# Altium project AI Gateway - Carrier.PrjPcb (part 2 of 2)

## Sheet 12-RS485.SchDoc
size A4
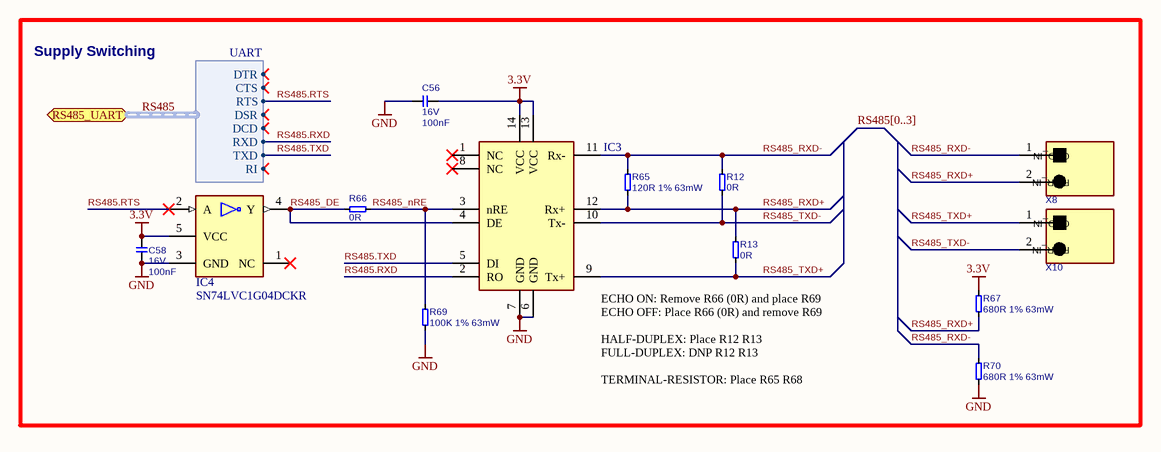
[diagram p7: 12-RS485.SchDoc]

### Parts
C56  value 100nF  Rating: 16V  [CAPC1005X60N]  (hidden comment: 100nF 16V 10% X7R)
C58  value 100nF  Rating: 16V  [CAPC1005X60N]  (hidden comment: 100nF 16V 10% X7R)
IC3  ISL83491IBZ-T  [SOIC127P600X175-14N]  (value not drawn)
IC4  SN74LVC1G04DCKR  [SOT65P210X110-5N]
R12  0R  [RESC1005X40N]
R13  0R  [RESC1005X40N]
R65  120R 1% 63mW  [RESC1005X40N]
R66  0R  [RESC1005X40N]
R67  680R 1% 63mW  [RESC1005X40N]
R69  100K 1% 63mW  [RESC1005X40N]
R70  680R 1% 63mW  [RESC1005X40N]
X8  1984617  [TERM-BLK-3.5MM]  (value not drawn)
X10  1984617  [TERM-BLK-3.5MM]  (value not drawn)

### Blocks framed on the sheet
Supply Switching: C56 C58 IC3 IC4 R12 R13 R65-R67 R69 R70 X8 X10

### Ports
RS485_UART (bidir, harness UART)

### Harnesses
UART: RTS, DSR, DCD, RXD, TXD, CTS, DTR, RI

### Nets
3.3V: C56.1 C58.2 IC3.13(VCC) IC3.14(VCC) IC4.5(VCC) R67.2
GND: C56.2 C58.1 IC3.6(GND) IC3.7(GND) IC4.3(GND) R69.1 R70.1
RS485.RTS: IC4.2(A) ; port RS485_UART.RTS
RS485.RXD: IC3.2(RO) ; port RS485_UART.RXD
RS485.TXD: IC3.5(DI) ; port RS485_UART.TXD
RS485_DE: IC3.4(DE) IC4.4(Y) R66.2
RS485_nRE: IC3.3(nRE) R66.1 R69.2
RS485_RXD+: IC3.12(Rx+) R13.2 R65.1 R67.1 X8.2(PWR_IN)
RS485_RXD-: IC3.11(Rx-) R12.1 R65.2 R70.2 X8.1(GND_IN)
RS485_TXD+: IC3.9(Tx+) R13.1 X10.1(GND_IN)
RS485_TXD-: IC3.10(Tx-) R12.2 X10.2(PWR_IN)

Not connected (* = marked no-connect by the designer): IC3 1(NC)* 8(NC)*; IC4 1(NC)*

### Buses and harness runs
bus RS485[0..3]
harness RS485 = port RS485_UART

### Notes on the sheet
- ECHO ON: Remove R66 (0R) and place R69
  ECHO OFF: Place R66 (0R) and remove R69
  HALF-DUPLEX: Place R12 R13
  FULL-DUPLEX: DNP R12 R13
  TERMINAL-RESISTOR: Place R65 R68

### Library data of the parts
C56 C58 = C-100nF-16V-10%-0603: Capacitor Ceramic X7R 100nF 16V 10% 0603; FP_DESC: C0402; Tolerance: 10%; Type: X7R; Supplier 1: Digi-Key; Supplier Part Number 1: 1276-1001-1-ND; Footprint Checked: -; MFG: *; MFG_PN: *
IC3 = IC-Renesas-ISL83491IBZ-T: Transceptor 1/1 Completo RS422, RS485 14-SOIC; MFG: Renesas Electronics America Inc; Supplier 1: Digi-Key; Supplier Part Number 1: ISL83491IBZ-TCT-ND; Symbol Checked: -; Footprint Checked: -; MFG_PN: ISL83491IBZ-T
IC4 = IC-TI-SN74LVC1G04: IC INVERTER 1CH 1-INP SC70-5; Symbol Checked: M - D; MFG: Texas Instruments; Supplier 1: Digi-Key; Supplier Part Number 1: 296-11600-1-ND; Footprint Checked: -; MFG_PN: SN74LVC1G04
R12 R13 R66 = R-0R-0402: Resistor 0ohm 0402; Tolerance: 1%; MFG: <GENERIC>; Power: ?; Value: 0R; Footprint: R0402; Supplier 1: Digi-Key; Supplier Part Number 1: 541-2952-1-ND; Footprint Checked: -; MFG_PN: <GENERIC>; Symbol Checked: -
R65 = R-120R-1%-0402: Resistor 120ohm 63mW 1% 0402; MFG: <GENERIC>; Power: 63mW; Tolerance: 1%; Footprint: R0402; Value: 120R; Supplier 1: Digi-Key; Supplier Part Number 1: 541-120LCT-ND; Footprint Checked: -; Symbol Checked: -; MFG_PN: <GENERIC>
R67 R70 = R-680R-1%-0402: Resistor 680ohm 63mW 1% 0402; Value: 680; MFG: <GENERIC>; Power: 63mW; Tolerance: 1%; Footprint: R0402; Supplier 1: Digi-Key; Supplier Part Number 1: 541-680LCT-ND; Footprint Checked: -; Symbol Checked: -; MFG_PN: <GENERIC>
R69 = R-100K-1%-0402: as R49 on sheet 07-USB; Power: 63mW; Tolerance: 1%; Value: 100k; Footprint: R0402; Supplier 1: Digi-Key; Supplier Part Number 1: 541-100KLCT-ND; Manufacturer Part Number: <GENERIC>
X8 X10 = CON-Phoenix-1984617-1x2-3.5mm: 2 Position Wire to Board Terminal Block Horizontal with Board 0.138" (3.50mm) Through Hole; No. of ways: 1x2; Pitch: 3.5mm; MFG: Phoenix Contact; Supplier 1: Digi-Key; Supplier Part Number 1: 277-1721-ND; Footprint Checked: -; MFG_PN: 1984617; Symbol Checked: -

## Sheet 05-SD CARD.SchDoc
size A4
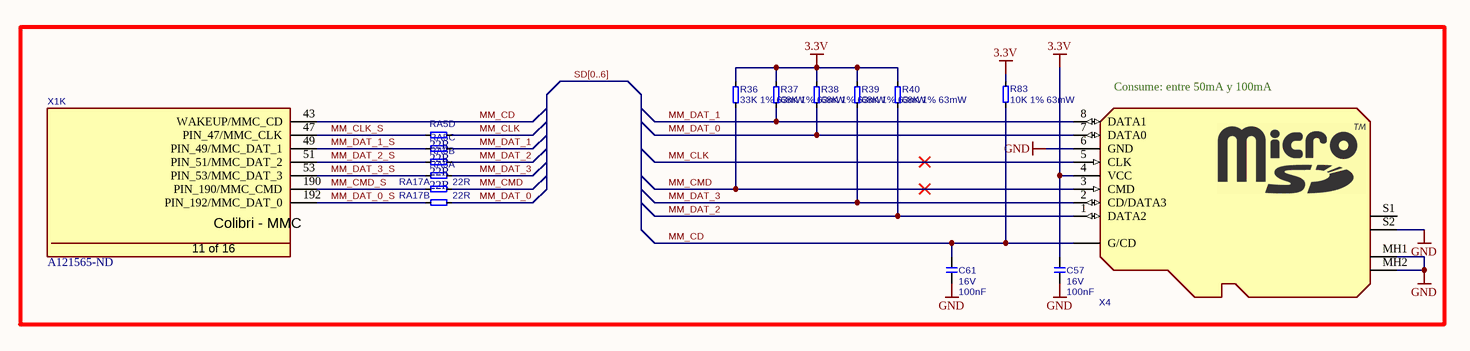
[diagram p8: 05-SD CARD.SchDoc]

### Parts
C57  value 100nF  Rating: 16V  [CAPC1005X60N]  (hidden comment: 100nF 16V 10% X7R)
C61  value 100nF  Rating: 16V  [CAPC1005X60N]  (hidden comment: 100nF 16V 10% X7R)
R36  33K 1% 63mW  [RESC1005X40N]
R37  68K 1% 63mW  [RESC1005X40N]
R38  68K 1% 63mW  [RESC1005X40N]
R39  68K 1% 63mW  [RESC1005X40N]
R40  68K 1% 63mW  [RESC1005X40N]
R83  10K 1% 63mW  [RESC1005X40N]
RA5  22R  [T_Resistor_Array_X4]  (parts A,B,C,D of 4)
RA17  22R  [T_Resistor_Array_X4]  (parts A,B of 4)
X1  Supplier Part Number 1: A121565-ND  [T_Tyco_1473005-1]  (hidden comment: 1473005-1)  (part K of 16)
X4  MEM2051-00-195-00-A  [101-00660-68-6+MEM2051-00-195-00-A_REVC]  (value not drawn)

### Blocks framed on the sheet
Consume: entre 50mA y 100mA: C57 C61 R36-R40 R83 RA5 RA17 X1 X4

### Nets
3.3V: C57.2 R36.2 R37.2 R38.2 R39.2 R40.2 R83.1 X4.4(VCC)
GND: C57.1 C61.1 X4.6(GND) X4.MH1(S) X4.MH2(S) X4.S2
MM_CD: C61.2 R83.2 X1.43(WAKEUP/MMC_CD) X4.G1(G/CD)
MM_CLK: RA5.4 X4.5(CLK)
MM_CLK_S: RA5.8 X1.47(PIN_47/MMC_CLK)
MM_CMD: R36.1 RA17.5 X4.3(CMD)
MM_CMD_S: RA17.1 X1.190(PIN_190/MMC_CMD)
MM_DAT_0: R38.1 RA17.6 X4.7(DATA0)
MM_DAT_0_S: RA17.2 X1.192(PIN_192/MMC_DAT_0)
MM_DAT_1: R37.1 RA5.3 X4.8(DATA1)
MM_DAT_1_S: RA5.7 X1.49(PIN_49/MMC_DAT_1)
MM_DAT_2: R40.1 RA5.2 X4.1(DATA2)
MM_DAT_2_S: RA5.6 X1.51(PIN_51/MMC_DAT_2)
MM_DAT_3: R39.1 RA5.1 X4.2(CD/DATA3)
MM_DAT_3_S: RA5.5 X1.53(PIN_53/MMC_DAT_3)

Not connected (* = marked no-connect by the designer): X4 S1

### Buses and harness runs
bus SD[0..6]

### Notes on the sheet
- (in symbol CON-Tyco-1473005-1-200-0.6mm, part K) Colibri - MMC; 11 of 16

### Library data of the parts
C57 C61 = C-100nF-16V-10%-0603: as C56 on sheet 12-RS485; Tolerance: 10%; Type: X7R; Supplier 1: Digi-Key; Supplier Part Number 1: 1276-1001-1-ND; Footprint Checked: -; MFG: *; MFG_PN: *
R36 = R-33K-1%-0402: Resistor 33Kohm 63mW 1% 0402; Value: 330; MFG: <GENERIC>; Power: 63mW; Tolerance: 1%; Footprint: R0402; Supplier 1: Digi-Key; Supplier Part Number 1: 541-33.0KLCT-ND; Footprint Checked: -; MFG_PN: <GENERIC>; Symbol Checked: -
R37-R40 = R-68K-1%-0402_1: Resistor 68Kohm 63mW 1% 0402; MFG: <GENERIC>; Symbol Checked: T; Power: 63mW; Tolerance: 1%; Footprint: R0402; Value: 68K; Supplier 1: Digi-Key; Supplier Part Number 1: 541-68.0KLCT-ND; Footprint Checked: -; MFG_PN: <GENERIC>
R83 = R-10K-1%-0402: Resistor 10Kohm 63mW 1% 0402; MFG: <GENERIC>; Power: 63mW; Tolerance: 1%; Value: 10k; Footprint: R0402; Supplier 1: Digi-Key; Supplier Part Number 1: 541-10.0KLDKR-ND; Footprint Checked: -; MFG_PN: <GENERIC>; Symbol Checked: -
RA5 RA17 = RA-22R-5%-1206-div: Resistor Array 22 R 63mW 5% 1206; MFG: Generic; Tolerance: 5%; Power Dissipation: 63mW; Supplier 1: Digi-Key; Value: 22R; Supplier Part Number 1: TC164J-22CT-ND; Footprint Checked: -; Symbol Checked: -
X1 = CON-Tyco-1473005-1-200-0.6mm: as X1 on sheet 06-ETHERNET; Supplier 1: Digi-Key; Manufacturer Part No.: 1473005-1
X4 = CON-GCT-SD-MEM2051-00-195-00-A: 9 (8 + 1) Position Card Connector microSD™ Surface Mount, Right Angle Gold; No. of ways: 9; MFG: GCT; MFG_PN: MEM2051-00-195-00-A; Footprint Checked: -; Symbol Checked: -; Supplier 1: DigiKey; Supplier Part Number 1: 2073-MEM2051-00-195-00-ACT-ND

## Sheet 03-SERIAL.SchDoc
size A4
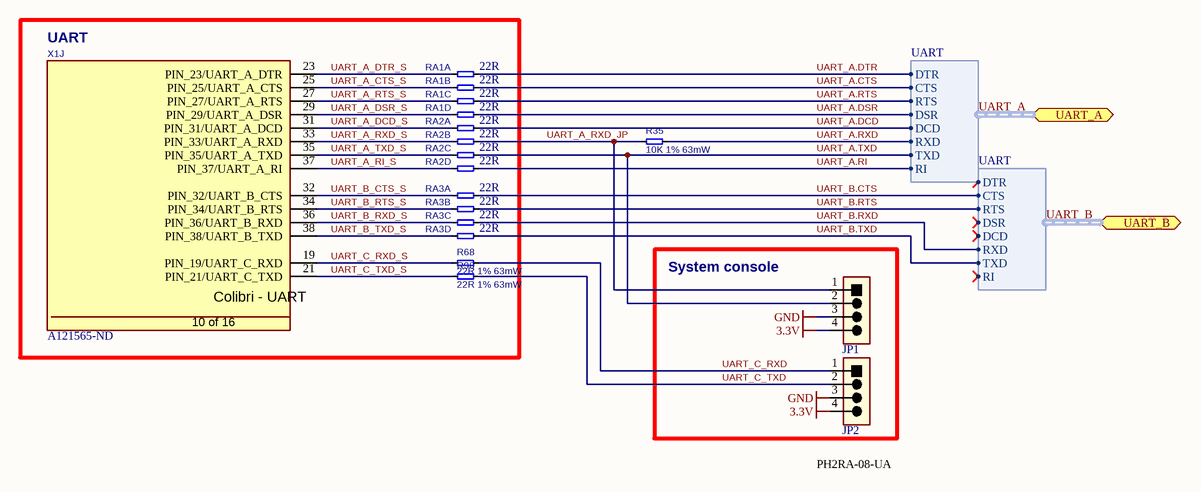
[diagram p9: 03-SERIAL.SchDoc]

### Parts
JP1  61300411121  [Header 1x4, 2.54mm pitch, male]  (value not drawn)
JP2  61300411121  [Header 1x4, 2.54mm pitch, male]  (value not drawn)
R35  10K 1% 63mW  [RESC1005X40N]
R68  22R 1% 63mW  [RESC1005X40N]
R90  22R 1% 63mW  [RESC1005X40N]
RA1  22R  [T_Resistor_Array_X4]  (parts A,B,C,D of 4)
RA2  22R  [T_Resistor_Array_X4]  (parts A,B,C,D of 4)
RA3  22R  [T_Resistor_Array_X4]  (parts A,B,C,D of 4)
X1  Supplier Part Number 1: A121565-ND  [T_Tyco_1473005-1]  (hidden comment: 1473005-1)  (part J of 16)

### Blocks framed on the sheet
UART: R68 R90 RA1-RA3 X1
System console: JP1 JP2

### Ports
UART_A (bidir, harness UART), UART_B (bidir, harness UART)

### Harnesses
UART: RTS, DSR, DCD, RXD, TXD, CTS, DTR, RI

### Nets
3.3V: JP1.4 JP2.4
GND: JP1.3 JP2.3
UART_A.CTS: RA1.2 ; port UART_A.CTS  [project net RS485.CTS]
UART_A.DCD: RA2.1 ; port UART_A.DCD  [project net RS485.DCD]
UART_A.DSR: RA1.4 ; port UART_A.DSR  [project net RS485.DSR]
UART_A.DTR: RA1.1 ; port UART_A.DTR  [project net RS485.DTR]
UART_A.RI: RA2.4 ; port UART_A.RI  [project net RS485.RI]
UART_A.RTS: RA1.3 ; port UART_A.RTS  [project net RS485.RTS]
UART_A.RXD: R35.1 ; port UART_A.RXD  [project net RS485.RXD]
UART_A.TXD: JP1.2 RA2.3 ; port UART_A.TXD  [project net RS485.TXD]
UART_A_CTS_S: RA1.6 X1.25(PIN_25/UART_A_CTS)
UART_A_DCD_S: RA2.5 X1.31(PIN_31/UART_A_DCD)
UART_A_DSR_S: RA1.8 X1.29(PIN_29/UART_A_DSR)
UART_A_DTR_S: RA1.5 X1.23(PIN_23/UART_A_DTR)
UART_A_RI_S: RA2.8 X1.37(PIN_37/UART_A_RI)
UART_A_RTS_S: RA1.7 X1.27(PIN_27/UART_A_RTS)
UART_A_RXD_JP: JP1.1 R35.2 RA2.2
UART_A_RXD_S: RA2.6 X1.33(PIN_33/UART_A_RXD)
UART_A_TXD_S: RA2.7 X1.35(PIN_35/UART_A_TXD)
UART_B.CTS: RA3.5 ; port UART_B.CTS  [project net NCP.CTS]
UART_B.RTS: RA3.6 ; port UART_B.RTS  [project net NCP.RTS]
UART_B.RXD: RA3.7 ; port UART_B.RXD  [project net NCP.RXD]
UART_B.TXD: RA3.8 ; port UART_B.TXD  [project net NCP.TXD]
UART_B_CTS_S: RA3.1 X1.32(PIN_32/UART_B_CTS)
UART_B_RTS_S: RA3.2 X1.34(PIN_34/UART_B_RTS)
UART_B_RXD_S: RA3.3 X1.36(PIN_36/UART_B_RXD)
UART_B_TXD_S: RA3.4 X1.38(PIN_38/UART_B_TXD)
UART_C_RXD: JP2.1 R68.1
UART_C_RXD_S: R68.2 X1.19(PIN_19/UART_C_RXD)
UART_C_TXD: JP2.2 R90.1
UART_C_TXD_S: R90.2 X1.21(PIN_21/UART_C_TXD)

### Buses and harness runs
harness UART_A = port UART_A
harness UART_B = port UART_B

### Notes on the sheet
- (near JP2) PH2RA-08-UA
- (in symbol CON-Tyco-1473005-1-200-0.6mm, part J) Colibri - UART; 10 of 16

### Library data of the parts
JP1 JP2 = Header 1x4: Header male, 1x4 Pins, 2.54 mm pitch; No. of ways: 1x2; Pitch: 2.54 mm; MFG: Würth Elektronik; Footprint Checked: -; MFG_PN: 61300411121; Symbol Checked: -; Supplier 1: Digi-Key; Supplier Part Number 1: 732-5317-ND
R35 = R-10K-1%-0402: as R83 on sheet 05-SD CARD; Power: 63mW; Tolerance: 1%; Value: 10k; Footprint: R0402; Supplier 1: Digi-Key; Supplier Part Number 1: 541-10.0KLDKR-ND; Footprint Checked: -; Symbol Checked: -; MFG_PN: <GENERIC>
R68 R90 = R-22R-1%-0402: Resistor 22ohm 63mW 1% 0402; Value: 22; MFG: <GENERIC>; Power: 63mW; Tolerance: 1%; Footprint: R0402; Supplier 1: Digi-Key; Supplier Part Number 1: 541-22.0LCT-ND; Footprint Checked: -; Symbol Checked: -; MFG_PN: <GENERIC>
RA1-RA3 = RA-22R-5%-1206-div: as RA5 on sheet 05-SD CARD; Tolerance: 5%; Power Dissipation: 63mW; Value: 22R; Supplier 1: Digi-Key; Supplier Part Number 1: TC164J-22CT-ND; Footprint Checked: -; Symbol Checked: -
X1 = CON-Tyco-1473005-1-200-0.6mm: as X1 on sheet 06-ETHERNET; Supplier 1: Digi-Key; Manufacturer Part No.: 1473005-1

## Sheet 01-SOM.SchDoc
size A3
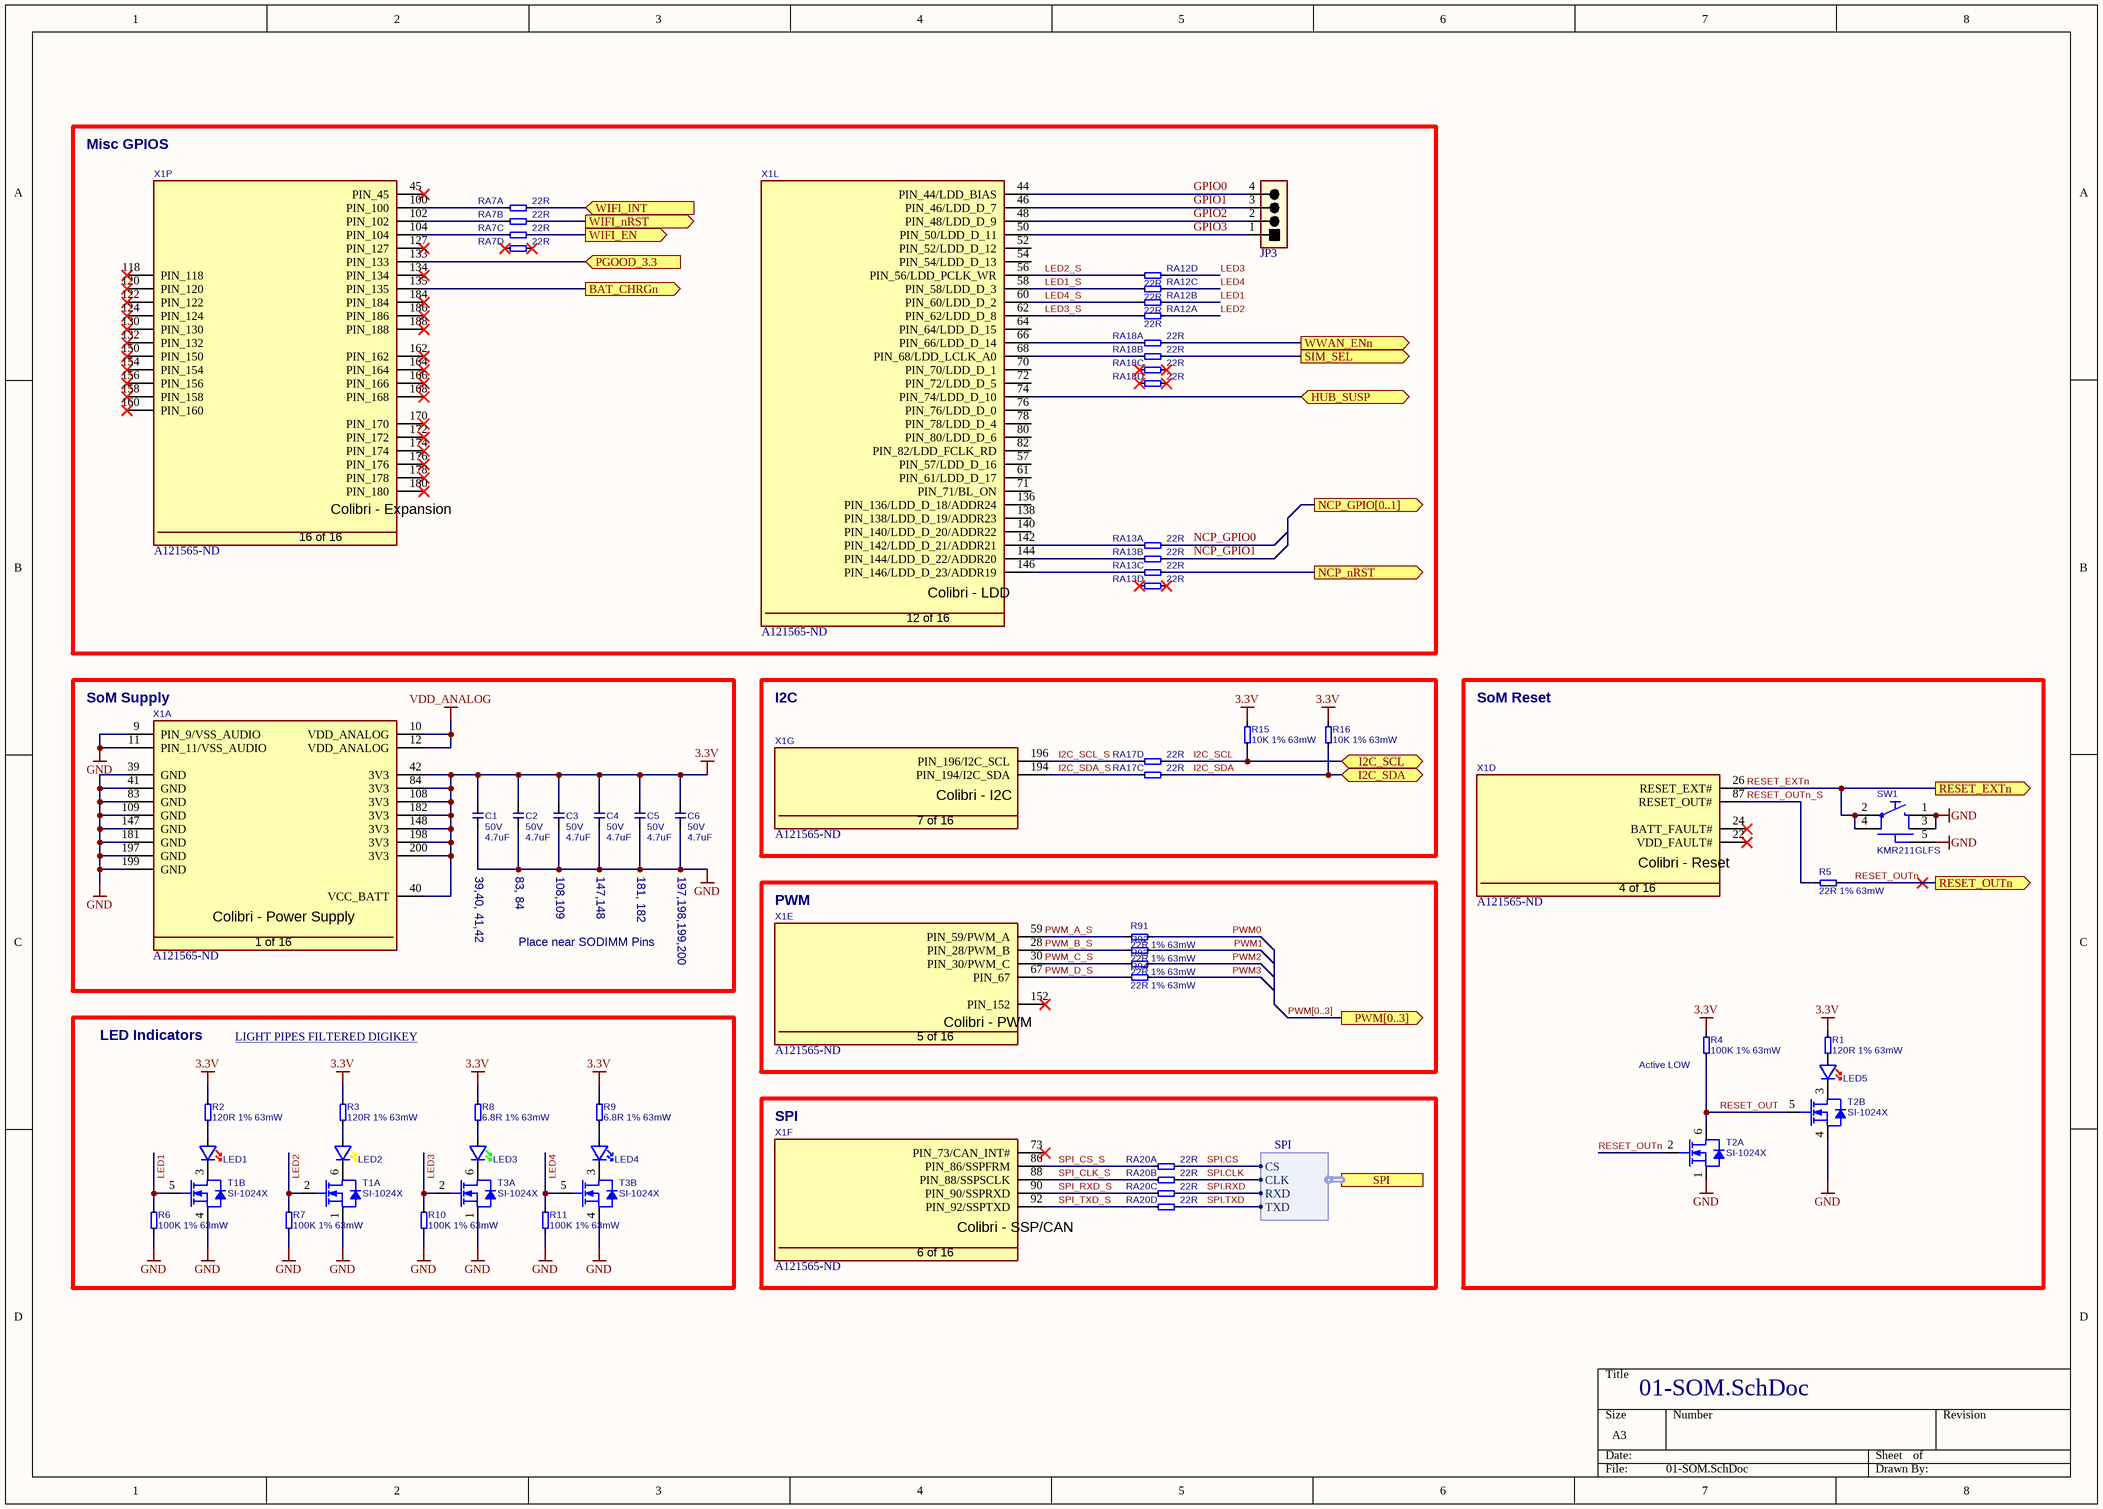
[diagram p10: 01-SOM.SchDoc]

### Parts
C1  value 4.7uF  Rating: 50V  [T_CAPC1206X180N]  (hidden comment: 4.7uF 50V 20% X7R)
C2  value 4.7uF  Rating: 50V  [T_CAPC1206X180N]  (hidden comment: 4.7uF 50V 20% X7R)
C3  value 4.7uF  Rating: 50V  [T_CAPC1206X180N]  (hidden comment: 4.7uF 50V 20% X7R)
C4  value 4.7uF  Rating: 50V  [T_CAPC1206X180N]  (hidden comment: 4.7uF 50V 20% X7R)
C5  value 4.7uF  Rating: 50V  [T_CAPC1206X180N]  (hidden comment: 4.7uF 50V 20% X7R)
C6  value 4.7uF  Rating: 50V  [T_CAPC1206X180N]  (hidden comment: 4.7uF 50V 20% X7R)
JP3  61300411121  [Header 1x4, 2.54mm pitch, male]  (value not drawn)
LED1  150060RS75000  [LEDC1608X80N]  (value not drawn)
LED2  150060YS75000  [LEDC1608X80N]  (value not drawn)
LED3  150060GS75000  [LEDC1608X80N]  (value not drawn)
LED4  150060BS75000  [LEDC1608X80N]  (value not drawn)
LED5  150060RS75000  [LEDC1608X80N]  (value not drawn)
R1  120R 1% 63mW  [RESC1005X40N]
R2  120R 1% 63mW  [RESC1005X40N]
R3  120R 1% 63mW  [RESC1005X40N]
R4  100K 1% 63mW  [RESC1005X40N]
R5  22R 1% 63mW  [RESC1005X40N]
R6  100K 1% 63mW  [RESC1005X40N]
R7  100K 1% 63mW  [RESC1005X40N]
R8  6.8R 1% 63mW  [RESC1005X40N]
R9  6.8R 1% 63mW  [RESC1005X40N]
R10  100K 1% 63mW  [RESC1005X40N]
R11  100K 1% 63mW  [RESC1005X40N]
R15  10K 1% 63mW  [RESC1005X40N]
R16  10K 1% 63mW  [RESC1005X40N]
R91  22R 1% 63mW  [RESC1005X40N]
R92  22R 1% 63mW  [RESC1005X40N]
R93  22R 1% 63mW  [RESC1005X40N]
R94  22R 1% 63mW  [RESC1005X40N]
RA7  22R  [T_Resistor_Array_X4]  (parts A,B,C,D of 4)
RA12  22R  [T_Resistor_Array_X4]  (parts A,B,C,D of 4)
RA13  22R  [T_Resistor_Array_X4]  (parts A,B,C,D of 4)
RA17  22R  [T_Resistor_Array_X4]  (parts C,D of 4)
RA18  22R  [T_Resistor_Array_X4]  (parts A,B,C,D of 4)
RA20  22R  [T_Resistor_Array_X4]  (parts A,B,C,D of 4)
SW1  KMR211GLFS  [T_CnK_KMR211GLFS]
T1  SI-1024X  [SOTFL50P160X60-6N]  (parts A,B of 2)
T2  SI-1024X  [SOTFL50P160X60-6N]  (parts A,B of 2)
T3  SI-1024X  [SOTFL50P160X60-6N]  (parts A,B of 2)
X1  Supplier Part Number 1: A121565-ND  [T_Tyco_1473005-1]  (hidden comment: 1473005-1)  (parts A,D,E,F,G,L,P of 16)

### Blocks framed on the sheet
Misc GPIOS: JP3 RA7 RA12 RA13 RA18 X1
SoM Supply: C1-C6 X1
I2C: R15 R16 RA17 X1
SoM Reset: LED5 R1 R4 R5 SW1 T2 X1
PWM: R91-R94 X1
LED Indicators: LED1-LED4 R2 R3 R6-R11 T1 T3
SPI: RA20 X1

### Ports
BAT_CHRGn (out), HUB_SUSP (bidir), I2C_SCL (bidir), I2C_SDA (bidir), NCP_GPIO[0..1] (out), NCP_nRST (out), PGOOD_3.3 (in), PWM[0..3] (out), RESET_EXTn (out), RESET_OUTn (out), SIM_SEL (out), SPI (harness SPI), WIFI_EN (out), WIFI_INT (in), WIFI_nRST (out), WWAN_ENn (out)

### Harnesses
SPI: CS, CLK, RXD, TXD

### Nets
3.3V: C1.2 C2.2 C3.2 C4.2 C5.2 C6.2 R1.2 R2.1 R3.1 R4.2 R8.1 R9.1 R15.2 R16.2 X1.40(VCC_BATT) X1.42(3V3) X1.84(3V3) X1.108(3V3) X1.148(3V3) X1.182(3V3) X1.198(3V3) X1.200(3V3)
GND: C1.1 C2.1 C3.1 C4.1 C5.1 C6.1 R6.2 R7.2 R10.2 R11.2 SW1.1 SW1.3 SW1.5 T1.1(S) T1.4(S) T2.1(S) T2.4(S) T3.1(S) T3.4(S) X1.9(PIN_9/VSS_AUDIO) X1.11(PIN_11/VSS_AUDIO) X1.39(GND) X1.41(GND) X1.83(GND) X1.109(GND) X1.147(GND) X1.181(GND) X1.197(GND) X1.199(GND)
VDD_ANALOG: X1.10(VDD_ANALOG) X1.12(VDD_ANALOG)
BAT_CHRGn: X1.135(PIN_135) ; port BAT_CHRGn
GPIO0: JP3.4 X1.44(PIN_44/LDD_BIAS)
GPIO1: JP3.3 X1.46(PIN_46/LDD_D_7)
GPIO2: JP3.2 X1.48(PIN_48/LDD_D_9)
GPIO3: JP3.1 X1.50(PIN_50/LDD_D_11)
HUB_SUSP: X1.74(PIN_74/LDD_D_10) ; port HUB_SUSP
I2C_SCL: R15.1 RA17.8 ; port I2C_SCL
I2C_SCL_S: RA17.4 X1.196(PIN_196/I2C_SCL)
I2C_SDA: R16.1 RA17.7 ; port I2C_SDA
I2C_SDA_S: RA17.3 X1.194(PIN_194/I2C_SDA)
LED1: R6.1 RA12.2 T1.5(G)
LED1_S: RA12.7 X1.58(PIN_58/LDD_D_3)
LED2: R7.1 RA12.1 T1.2(G)
LED2_S: RA12.8 X1.56(PIN_56/LDD_PCLK_WR)
LED3: R10.1 RA12.4 T3.2(G)
LED3_S: RA12.5 X1.62(PIN_62/LDD_D_8)
LED4: R11.1 RA12.3 T3.5(G)
LED4_S: RA12.6 X1.60(PIN_60/LDD_D_2)
NCP_GPIO0: RA13.5
NCP_GPIO1: RA13.6
NCP_nRST: RA13.7 ; port NCP_nRST
PGOOD_3.3: X1.133(PIN_133) ; port PGOOD_3.3
PWM0: R91.1
PWM1: R92.1
PWM2: R93.1
PWM3: R94.1
PWM_A_S: R91.2 X1.59(PIN_59/PWM_A)
PWM_B_S: R92.2 X1.28(PIN_28/PWM_B)
PWM_C_S: R93.2 X1.30(PIN_30/PWM_C)
PWM_D_S: R94.2 X1.67(PIN_67)
RESET_EXTn: SW1.2 SW1.4 X1.26(RESET_EXT#) ; port RESET_EXTn
RESET_OUT: R4.1 T2.5(G) T2.6(D)
RESET_OUTn: R5.1 T2.2(G) ; port RESET_OUTn
RESET_OUTn_S: R5.2 X1.87(RESET_OUT#)
SIM_SEL: RA18.6 ; port SIM_SEL
SPI.CLK: RA20.6 ; port SPI.CLK
SPI.CS: RA20.5 ; port SPI.CS
SPI.RXD: RA20.7 ; port SPI.RXD
SPI.TXD: RA20.8 ; port SPI.TXD
SPI_CLK_S: RA20.2 X1.88(PIN_88/SSPSCLK)
SPI_CS_S: RA20.1 X1.86(PIN_86/SSPFRM)
SPI_RXD_S: RA20.3 X1.90(PIN_90/SSPRXD)
SPI_TXD_S: RA20.4 X1.92(PIN_92/SSPTXD)
WIFI_EN: RA7.7 ; port WIFI_EN
WIFI_INT: RA7.5 ; port WIFI_INT
WIFI_nRST: RA7.6 ; port WIFI_nRST
WWAN_ENn: RA18.5 ; port WWAN_ENn
NetLED1_1: LED1.1 T1.3(D)
NetLED1_2: LED1.2 R2.2
NetLED2_1: LED2.1 T1.6(D)
NetLED2_2: LED2.2 R3.2
NetLED3_1: LED3.1 T3.6(D)
NetLED3_2: LED3.2 R8.2
NetLED4_1: LED4.1 T3.3(D)
NetLED4_2: LED4.2 R9.2
NetLED5_1: LED5.1 T2.3(D)
NetLED5_2: LED5.2 R1.1
NetRA7_1: RA7.1 X1.100(PIN_100)
NetRA7_2: RA7.2 X1.102(PIN_102)
NetRA7_3: RA7.3 X1.104(PIN_104)
NetRA13_1: RA13.1 X1.142(PIN_142/LDD_D_21/ADDR21)
NetRA13_2: RA13.2 X1.144(PIN_144/LDD_D_22/ADDR20)
NetRA13_3: RA13.3 X1.146(PIN_146/LDD_D_23/ADDR19)
NetRA18_1: RA18.1 X1.66(PIN_66/LDD_D_14)
NetRA18_2: RA18.2 X1.68(PIN_68/LDD_LCLK_A0)

Not connected (* = marked no-connect by the designer): RA7 4* 8*; RA13 4* 8*; RA18 3* 4* 7* 8*; X1 22(VDD_FAULT#)* 24(BATT_FAULT#)* 45(PIN_45)* 52(PIN_52/LDD_D_12) 54(PIN_54/LDD_D_13) 57(PIN_57/LDD_D_16) 61(PIN_61/LDD_D_17) 64(PIN_64/LDD_D_15) 70(PIN_70/LDD_D_1) 71(PIN_71/BL_ON) 72(PIN_72/LDD_D_5) 73(PIN_73/CAN_INT#)* 76(PIN_76/LDD_D_0) 78(PIN_78/LDD_D_4) 80(PIN_80/LDD_D_6) 82(PIN_82/LDD_FCLK_RD) 118(PIN_118)* 120(PIN_120)* 122(PIN_122)* 124(PIN_124)* 127(PIN_127)* 130(PIN_130)* 132(PIN_132)* 134(PIN_134)* 136(PIN_136/LDD_D_18/ADDR24) 138(PIN_138/LDD_D_19/ADDR23) 140(PIN_140/LDD_D_20/ADDR22) 150(PIN_150)* 152(PIN_152)* 154(PIN_154)* 156(PIN_156)* 158(PIN_158)* 160(PIN_160)* 162(PIN_162)* 164(PIN_164)* 166(PIN_166)* 168(PIN_168)* 170(PIN_170)* 172(PIN_172)* 174(PIN_174)* 176(PIN_176)* 178(PIN_178)* 180(PIN_180)* 184(PIN_184)* 186(PIN_186)* 188(PIN_188)*

### Buses and harness runs
bus PWM[0..3] = port PWM[0..3]

### Notes on the sheet
- 39,40, 41,42
- 83, 84
- 108,109
- 147,148
- 181, 182
- 197,198,199,200
- Place near SODIMM Pins
- LIGHT PIPES FILTERED DIGIKEY <https://www.digikey.com/products/en/optoelectronics/optics-light-pipes/102?k=light+pipes&k=&pkeyword=light+pipes&sv=0&pv2029=170365&pv2029=202209&sf=1&FV=37%7C330893%2C37%7C330951%2C-8%7C102%2C2028%7C398078&quantity=&ColumnSort=1000011&page=1&stock=1&nstock=1&pageSize=250>
- (near R4) Active LOW
- (in symbol CON-Tyco-1473005-1-200-0.6mm, part A) Colibri - Power Supply; 1 of 16
- (in symbol CON-Tyco-1473005-1-200-0.6mm, part D) Colibri - Reset; 4 of 16
- (in symbol CON-Tyco-1473005-1-200-0.6mm, part E) Colibri - PWM; 5 of 16
- (in symbol CON-Tyco-1473005-1-200-0.6mm, part F) Colibri - SSP/CAN; 6 of 16
- (in symbol CON-Tyco-1473005-1-200-0.6mm, part G) Colibri - I2C; 7 of 16
- (in symbol CON-Tyco-1473005-1-200-0.6mm, part L) Colibri - LDD; 12 of 16
- (in symbol CON-Tyco-1473005-1-200-0.6mm, part P) Colibri - Expansion; 16 of 16

### Library data of the parts
C1-C6 = C-4.7uF-50V-20%-1210: Capacitor Ceramic X7R 4.7uF 50V 20% 1206; Tolerance: 10%; FP_DESC: C1206; Type: X7R; Supplier 1: Digi-Key; Supplier Part Number 1: 1276-2789-1-ND; MFG: *; MFG_PN: *
JP3 = Header 1x4: as JP1 on sheet 03-SERIAL; Footprint Checked: -; MFG_PN: 61300411121; Symbol Checked: -; Supplier 1: Digi-Key; Supplier Part Number 1: 732-5317-ND
LED1 LED5 = LED-RED-0603: Red 625nm LED Indication - Discrete 2V 0603 (1608 Metric); MFG: Würth Elektronik; MFG_PN: 150060RS75000; Color: Red; Supplier 1: Digi-Key; Supplier Part Number 1: 732-4978-1-ND; Footprint Checked: -; Symbol Checked: -
LED2 = LED-YELLOW-0603: Yellow 590nm LED Indication - Discrete 2V 0603 (1608 Metric); MFG: Würth Elektronik; MFG_PN: 150060YS75000; Color: Yellow; Supplier 1: Digi-Key; Supplier Part Number 1: 732-4981-1-ND; Footprint Checked: -; Symbol Checked: -
LED3 = LED-GREEN-0603: Green 520nm LED Indication - Discrete 3.2V 0603 (1608 Metric); MFG: Würth Elektronik; MFG_PN: 150060GS75000; Color: Green; Supplier 1: Digi-Key; Supplier Part Number 1: 732-4971-1-ND; Footprint Checked: -; Symbol Checked: -
LED4 = LED-BLUE-0603: Blue 470nm LED Indication - Discrete 3.2V 0603 (1608 Metric); MFG: Würth Elektronik; MFG_PN: 150060BS75000; Color: Blue; Supplier 1: Digi-Key; Supplier Part Number 1: 732-4966-1-ND; Footprint Checked: -; Symbol Checked: -
R1-R3 = R-120R-1%-0402: as R65 on sheet 12-RS485; Power: 63mW; Tolerance: 1%; Footprint: R0402; Value: 120R; Supplier 1: Digi-Key; Supplier Part Number 1: 541-120LCT-ND; Footprint Checked: -; Symbol Checked: -; MFG_PN: <GENERIC>
R4 R6 R7 R10 R11 = R-100K-1%-0402: as R49 on sheet 07-USB; Power: 63mW; Tolerance: 1%; Value: 100k; Footprint: R0402; Supplier 1: Digi-Key; Supplier Part Number 1: 541-100KLCT-ND; Manufacturer Part Number: <GENERIC>
R5 R91-R94 = R-22R-1%-0402: as R68 on sheet 03-SERIAL; Power: 63mW; Tolerance: 1%; Footprint: R0402; Supplier 1: Digi-Key; Supplier Part Number 1: 541-22.0LCT-ND; Footprint Checked: -; Symbol Checked: -; MFG_PN: <GENERIC>
R8 R9 = R-6.8R-1%-0402: Resistor 6.8ohm 63mW 1% 0402; Manufacturer: <GENERIC>; Replacement Allowed: Yes; Power: 63mW; Tolerance: 1%; Footprint: R0402; Value: 6.8R; Supplier 1: Digi-Key; Supplier Part Number 1: 541-68.0LCT-ND; Manufacturer Part Number: <GENERIC>
R15 R16 = R-10K-1%-0402: as R83 on sheet 05-SD CARD; Power: 63mW; Tolerance: 1%; Value: 10k; Footprint: R0402; Supplier 1: Digi-Key; Supplier Part Number 1: 541-10.0KLDKR-ND; Footprint Checked: -; Symbol Checked: -; MFG_PN: <GENERIC>
RA7 RA12 RA13 RA17 RA18 RA20 = RA-22R-5%-1206-div: as RA5 on sheet 05-SD CARD; Tolerance: 5%; Value: 22R; Power Dissipation: 63mW; Supplier 1: Digi-Key; Supplier Part Number 1: TC164J-22CT-ND; Footprint Checked: -; Symbol Checked: -
SW1 = SW-KMR211GLFS-1VA: Power ON Switch; Rating: 1VA; MFG: C&N; Supplier 1: Digi-Key; Supplier Part Number 1: 401-1426-1-ND; Footprint Checked: -; Symbol Checked: -; MFG_PN: KMR211GLFS
T1-T3 = T-Vishay-SI-1024X: Mosfet Array 2 N-Channel (Dual) 20V 485mA 250mW Surface Mount SC-89-6; MFG: Vishay; MFG_PN: SI-1024-X; Supplier 1: Digi-Key; Supplier Part Number 1: SI1024X-T1-GE3CT-ND; Footprint Checked: -; Symbol Checked: -
X1 = CON-Tyco-1473005-1-200-0.6mm: as X1 on sheet 06-ETHERNET; Supplier 1: Digi-Key; Manufacturer Part No.: 1473005-1

## Sheet 11-ANALOG.SchDoc
size A4
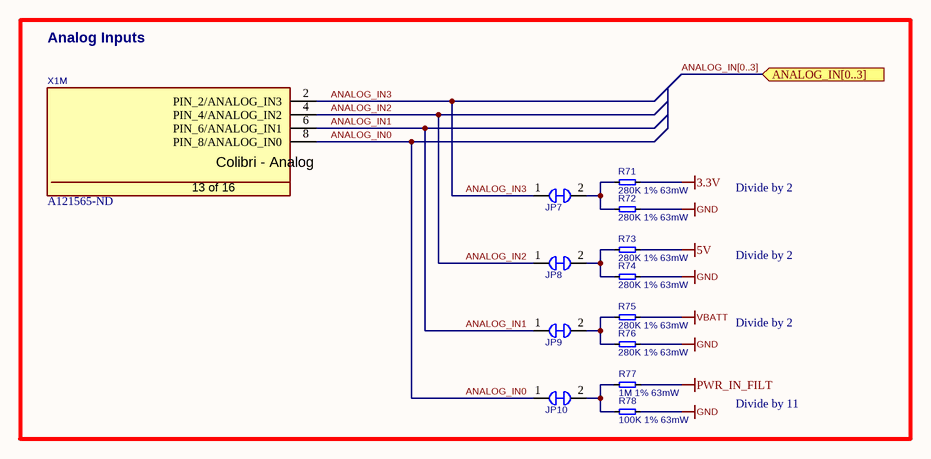
[diagram p11: 11-ANALOG.SchDoc]

### Parts
JP7  Jumper NC SMD  [NC]  (value not drawn)  (net tie, no BOM)
JP8  Jumper NC SMD  [NC]  (value not drawn)  (net tie, no BOM)
JP9  Jumper NC SMD  [NC]  (value not drawn)  (net tie, no BOM)
JP10  Jumper NC SMD  [NC]  (value not drawn)  (net tie, no BOM)
R71  280K 1% 63mW  [RESC1005X40N]
R72  280K 1% 63mW  [RESC1005X40N]
R73  280K 1% 63mW  [RESC1005X40N]
R74  280K 1% 63mW  [RESC1005X40N]
R75  280K 1% 63mW  [RESC1005X40N]
R76  280K 1% 63mW  [RESC1005X40N]
R77  1M 1% 63mW  [RESC1005X40N]
R78  100K 1% 63mW  [RESC1005X40N]
X1  Supplier Part Number 1: A121565-ND  [T_Tyco_1473005-1]  (hidden comment: 1473005-1)  (part M of 16)

### Ports
ANALOG_IN[0..3] (in)

### Nets
3.3V: R71.2
5V: R73.2
GND: R72.2 R74.2 R76.2 R78.1
PWR_IN_FILT: R77.1
VBATT: R75.2
ANALOG_IN0: JP10.1 X1.8(PIN_8/ANALOG_IN0)
ANALOG_IN1: JP9.1 X1.6(PIN_6/ANALOG_IN1)
ANALOG_IN2: JP8.1 X1.4(PIN_4/ANALOG_IN2)
ANALOG_IN3: JP7.1 X1.2(PIN_2/ANALOG_IN3)
NetJP7_2: JP7.2 R71.1 R72.1
NetJP8_2: JP8.2 R73.1 R74.1
NetJP9_2: JP9.2 R75.1 R76.1
NetJP10_2: JP10.2 R77.2 R78.2

### Buses and harness runs
bus ANALOG_IN[0..3] = port ANALOG_IN[0..3]

### Notes on the sheet
- Analog Inputs
- Divide by 2
- Divide by 11
- (in symbol CON-Tyco-1473005-1-200-0.6mm, part M) Colibri - Analog; 13 of 16

### Library data of the parts
JP7-JP10 = Jumper NC SMD: SMD jumper normally closed; Footprint Checked: -; Symbol Checked: -
R71-R76 = R-280K-1%-0402: Resistor 280Kohm 63mW 1% 0402; MFG: <GENERIC>; Power: 63mW; Tolerance: 1%; Footprint: R0402; Value: 280k; Supplier 1: Digi-Key; Supplier Part Number 1: 541-280KLCT-ND; Footprint Checked: -; Symbol Checked: -; MFG_PN: <GENERIC>
R77 = R-1M-1%-0402: Resistor 1Mohm 63mW 1% 0402; Manufacturer: <GENERIC>; Replacement Allowed: Yes; Power: 63mW; Tolerance: 1%; Footprint: R0402; Value: 1M; Supplier 1: Digi-Key; Supplier Part Number 1: 541-1.00MLCT-ND; Manufacturer Part Number: <GENERIC>
R78 = R-100K-1%-0402: Resistor 100Kohm 63mW 1% 0402; Manufacturer: <GENERIC>; Replacement Allowed: Yes; Power: 63mW; Tolerance: 1%; Value: 100k; Footprint: R0402; Supplier 1: Digi-Key; Supplier Part Number 1: 541-100KLCT-ND; Manufacturer Part Number: <GENERIC>
X1 = CON-Tyco-1473005-1-200-0.6mm: SODIMM Connector; Manufacturer Name: Tyco; No. of ways: 200; Supplier 1: Digi-Key; Manufacturer Part No.: 1473005-1

## Sheet 13-EXTENSION.SchDoc
size A4
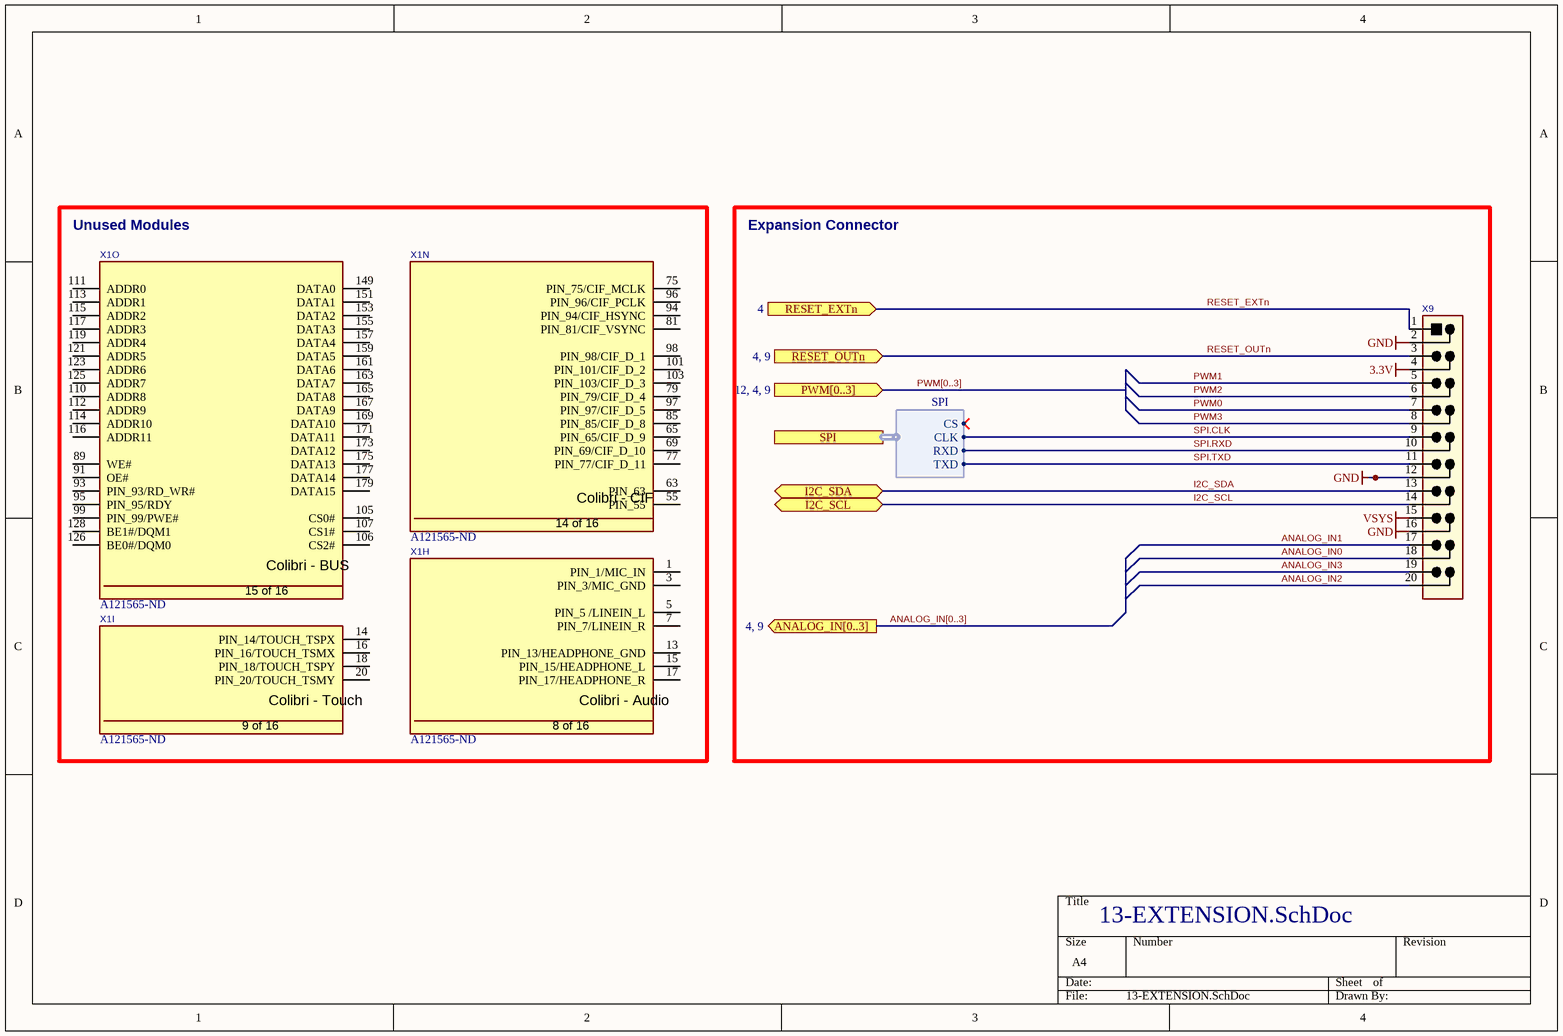
[diagram p12: 13-EXTENSION.SchDoc]

### Parts
X1  Supplier Part Number 1: A121565-ND  [T_Tyco_1473005-1]  (hidden comment: 1473005-1)  (parts H,I,N,O of 16)
X9  PH2-20-UA  [T_JVE_21B22564-40S10B-01G]  (value not drawn)

### Blocks framed on the sheet
Unused Modules: X1
Expansion Connector: X9

### Ports
ANALOG_IN[0..3] (out, see 4, 9), I2C_SCL (bidir), I2C_SDA (bidir), PWM[0..3] (in, see 12, 4, 9), RESET_EXTn (in, see 4), RESET_OUTn (in, see 4, 9), SPI (harness SPI)

### Harnesses
SPI: CS, CLK, RXD, TXD

### Nets
3.3V: X9.4
GND: X9.2 X9.12 X9.16
VSYS: X9.15
ANALOG_IN0: X9.18
ANALOG_IN1: X9.17
ANALOG_IN2: X9.20
ANALOG_IN3: X9.19
I2C_SCL: X9.14 ; port I2C_SCL
I2C_SDA: X9.13 ; port I2C_SDA
PWM0: X9.7
PWM1: X9.5
PWM2: X9.6
PWM3: X9.8
RESET_EXTn: X9.1 ; port RESET_EXTn
RESET_OUTn: X9.3 ; port RESET_OUTn
SPI.CLK: X9.9 ; port SPI.CLK
SPI.RXD: X9.10 ; port SPI.RXD
SPI.TXD: X9.11 ; port SPI.TXD

Not connected (* = marked no-connect by the designer): X1 1(PIN_1/MIC_IN) 3(PIN_3/MIC_GND) 5(PIN_5_/LINEIN_L) 7(PIN_7/LINEIN_R) 13(PIN_13/HEADPHONE_GND) 14(PIN_14/TOUCH_TSPX) 15(PIN_15/HEADPHONE_L) 16(PIN_16/TOUCH_TSMX) 17(PIN_17/HEADPHONE_R) 18(PIN_18/TOUCH_TSPY) 20(PIN_20/TOUCH_TSMY) 55(PIN_55) 63(PIN_63) 65(PIN_65/CIF_D_9) 69(PIN_69/CIF_D_10) 75(PIN_75/CIF_MCLK) 77(PIN_77/CIF_D_11) 79(PIN_79/CIF_D_4) 81(PIN_81/CIF_VSYNC) 85(PIN_85/CIF_D_8) 89(WE#) 91(OE#) 93(PIN_93/RD_WR#) 94(PIN_94/CIF_HSYNC) 95(PIN_95/RDY) 96(PIN_96/CIF_PCLK) 97(PIN_97/CIF_D_5) 98(PIN_98/CIF_D_1) 99(PIN_99/PWE#) 101(PIN_101/CIF_D_2) 103(PIN_103/CIF_D_3) 105(CS0#) 106(CS2#) 107(CS1#) 110(ADDR8) 111(ADDR0) 112(ADDR9) 113(ADDR1) 114(ADDR10) 115(ADDR2) 116(ADDR11) 117(ADDR3) 119(ADDR4) 121(ADDR5) 123(ADDR6) 125(ADDR7) 126(BE0#/DQM0) 128(BE1#/DQM1) 149(DATA0) 151(DATA1) 153(DATA2) 155(DATA3) 157(DATA4) 159(DATA5) 161(DATA6) 163(DATA7) 165(DATA8) 167(DATA9) 169(DATA10) 171(DATA11) 173(DATA12) 175(DATA13) 177(DATA14) 179(DATA15)

### Buses and harness runs
bus ANALOG_IN[0..3] = port ANALOG_IN[0..3]
bus PWM[0..3] = port PWM[0..3]

### Notes on the sheet
- (in symbol CON-Tyco-1473005-1-200-0.6mm, part H) Colibri - Audio; 8 of 16
- (in symbol CON-Tyco-1473005-1-200-0.6mm, part I) Colibri - Touch; 9 of 16
- (in symbol CON-Tyco-1473005-1-200-0.6mm, part N) Colibri - CIF; 14 of 16
- (in symbol CON-Tyco-1473005-1-200-0.6mm, part O) Colibri - BUS; 15 of 16

### Library data of the parts
X1 = CON-Tyco-1473005-1-200-0.6mm: as X1 on sheet 11-ANALOG; Supplier 1: Digi-Key; Manufacturer Part No.: 1473005-1
X9 = CON-Adam-PH2-20-UA-2X10-2.54mm: Connector Header Through Hole 20 position 0.100" (2.54mm); No. of ways: 2X20; MFG: FCI; MFG_PN: 68691-420HLF; Supplier 1: Digi-Key; Supplier Part Number 1: 2057-PH2-20-UA-ND; Footprint Checked: -; Symbol Checked: -

## Nets that join several sheets
3.3V: 06-ETHERNET (L5.2 X5.9 X5.11), 07-USB (10 pins), 02-POWER SUPPLY (11 pins), 09-WIFI (6 pins), 10-MODEM (R79.2 R80.2 T7.2 U6.14), 12-RS485 (6 pins), 05-SD CARD (8 pins), 03-SERIAL (JP1.4 JP2.4), 01-SOM (22 pins), 11-ANALOG (R71.2), 13-EXTENSION (X9.4)
5V: 07-USB (C7.2 L9.1 L12.1 U11.7), 02-POWER SUPPLY (11 pins), 11-ANALOG (R73.2)
CHASSIS_GND: 06-ETHERNET (X5.8 X5.S1 X5.S2), 07-USB (X6.S1 X6.S2 X7.S1 X7.S2), 02-POWER SUPPLY (5 pins), 10-MODEM (8 pins)
GND: 06-ETHERNET (7 pins), 07-USB (24 pins), 02-POWER SUPPLY (37 pins), 08-THREAD (X11.12), 09-WIFI (20 pins), 10-MODEM (34 pins), 12-RS485 (7 pins), 05-SD CARD (6 pins), 03-SERIAL (JP1.3 JP2.3), 01-SOM (29 pins), 11-ANALOG (R72.2 R74.2 R76.2 R78.1), 13-EXTENSION (X9.2 X9.12 X9.16)
PWR_IN_FILT: 02-POWER SUPPLY (7 pins), 11-ANALOG (R77.1)
VBATT: 02-POWER SUPPLY (7 pins), 11-ANALOG (R75.2)
VDD_ANALOG: 02-POWER SUPPLY (C20.2 IC7.5), 01-SOM (X1.10 X1.12)
VSYS: 02-POWER SUPPLY (6 pins), 08-THREAD (X11.11), 13-EXTENSION (X9.15)
ANALOG_IN0: 11-ANALOG (JP10.1 X1.8), 13-EXTENSION (X9.18)
ANALOG_IN1: 11-ANALOG (JP9.1 X1.6), 13-EXTENSION (X9.17)
ANALOG_IN2: 11-ANALOG (JP8.1 X1.4), 13-EXTENSION (X9.20)
ANALOG_IN3: 11-ANALOG (JP7.1 X1.2), 13-EXTENSION (X9.19)
BAT_CHRGn: 02-POWER SUPPLY (R27.1 U2.1), 01-SOM (X1.135)
HUB_SUSP: 07-USB (R89.2), 01-SOM (X1.74)
I2C_SCL: 07-USB (R84.2), 01-SOM (R15.1 RA17.8), 13-EXTENSION (X9.14)
I2C_SDA: 07-USB (R85.2), 01-SOM (R16.1 RA17.7), 13-EXTENSION (X9.13)
NCP.CTS: 08-THREAD (X11.20), 03-SERIAL (RA3.5)
NCP.RTS: 08-THREAD (X11.14), 03-SERIAL (RA3.6)
NCP.RXD: 08-THREAD (X11.18), 03-SERIAL (RA3.7)
NCP.TXD: 08-THREAD (X11.16), 03-SERIAL (RA3.8)
NCP_nRST: 08-THREAD (X11.17), 01-SOM (RA13.7)
PGOOD_3.3: 02-POWER SUPPLY (R32.1 U3.14), 01-SOM (X1.133)
PWM0: 01-SOM (R91.1), 13-EXTENSION (X9.7)
PWM1: 01-SOM (R92.1), 13-EXTENSION (X9.5)
PWM2: 01-SOM (R93.1), 13-EXTENSION (X9.6)
PWM3: 01-SOM (R94.1), 13-EXTENSION (X9.8)
RESET_EXTn: 01-SOM (SW1.2 SW1.4 X1.26), 13-EXTENSION (X9.1)
RESET_OUTn: 07-USB (U10.15), 09-WIFI (C47.2 R60.2 U4.7), 01-SOM (R5.1 T2.2), 13-EXTENSION (X9.3)
RS485.RTS: 12-RS485 (IC4.2), 03-SERIAL (RA1.3)
RS485.RXD: 12-RS485 (IC3.2), 03-SERIAL (R35.1)
RS485.TXD: 12-RS485 (IC3.5), 03-SERIAL (JP1.2 RA2.3)
SIM_SEL: 10-MODEM (U6.2), 01-SOM (RA18.6)
SPI.CLK: 09-WIFI (U4.23), 01-SOM (RA20.6), 13-EXTENSION (X9.9)
SPI.CS: 09-WIFI (U4.25), 01-SOM (RA20.5)
SPI.RXD: 09-WIFI (U4.24), 01-SOM (RA20.7), 13-EXTENSION (X9.10)
SPI.TXD: 09-WIFI (U4.26), 01-SOM (RA20.8), 13-EXTENSION (X9.11)
USBA_N: 07-USB (L14.3), 10-MODEM (CN4.36)
USBA_P: 07-USB (L14.2), 10-MODEM (CN4.38)
WIFI_EN: 09-WIFI (R59.2 U4.19), 01-SOM (RA7.7)
WIFI_INT: 09-WIFI (R58.1 U4.33), 01-SOM (RA7.5)
WWAN_ENn: 10-MODEM (R80.1 T8.2), 01-SOM (RA18.5)

## Assembly variants
AI_Gateway_Carrier_Proto: not fitted C36 C37 C42 C43 C45 C46 C47 C54 FB1 IC5 L16 OSC2 R12 R13 R14 R17 R18 R19 R36 R37 R38 R39 R40 R54 R55 R56 R57 R58 R59 R60 R61 R66 R82 R84 R85 R89 U4 U4 U8